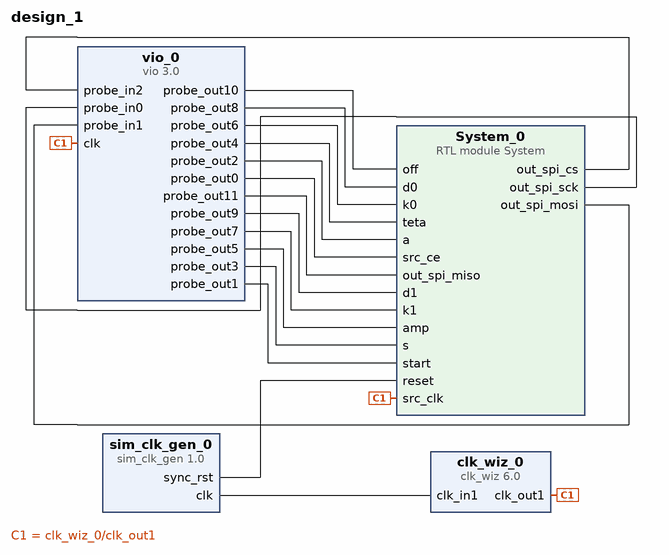
[diagram p0: block diagram of the top level]
# Vivado block design design_1, xc7s100fgga676-2, Vivado 2019.2
create_bd_design design_1

create_bd_cell -type ip -vlnv xilinx.com:ip:clk_wiz:6.0 clk_wiz_0
set_property -dict {CONFIG.USE_LOCKED false CONFIG.USE_RESET false} [get_bd_cells clk_wiz_0]
create_bd_cell -type ip -vlnv xilinx.com:ip:sim_clk_gen:1.0 sim_clk_gen_0
set_property -dict {CONFIG.RESET_POLARITY ACTIVE_LOW} [get_bd_cells sim_clk_gen_0]
create_bd_cell -type ip -vlnv xilinx.com:ip:vio:3.0 vio_0
set_property -dict [list \
  CONFIG.C_NUM_PROBE_IN 3 \
  CONFIG.C_NUM_PROBE_OUT 12 \
  CONFIG.C_PROBE_OUT0_INIT_VAL 0x1 \
  CONFIG.C_PROBE_OUT10_WIDTH 12 \
  CONFIG.C_PROBE_OUT1_INIT_VAL 0x1 \
  CONFIG.C_PROBE_OUT2_INIT_VAL 0x1 \
  CONFIG.C_PROBE_OUT2_WIDTH 4 \
  CONFIG.C_PROBE_OUT3_WIDTH 2 \
  CONFIG.C_PROBE_OUT4_WIDTH 8 \
  CONFIG.C_PROBE_OUT5_WIDTH 4 \
  CONFIG.C_PROBE_OUT6_INIT_VAL 0x10 \
  CONFIG.C_PROBE_OUT6_WIDTH 8 \
  CONFIG.C_PROBE_OUT7_INIT_VAL 0x10 \
  CONFIG.C_PROBE_OUT7_WIDTH 8 \
  CONFIG.C_PROBE_OUT8_INIT_VAL 0x08 \
  CONFIG.C_PROBE_OUT8_WIDTH 8 \
  CONFIG.C_PROBE_OUT9_INIT_VAL 0x08 \
  CONFIG.C_PROBE_OUT9_WIDTH 8 \
] [get_bd_cells vio_0]
create_bd_cell -type module -reference System System_0

# ---- connections ----

connect_bd_net [get_bd_pins sim_clk_gen_0/clk] [get_bd_pins clk_wiz_0/clk_in1]
connect_bd_net [get_bd_pins clk_wiz_0/clk_out1] [get_bd_pins vio_0/clk] [get_bd_pins System_0/src_clk]
connect_bd_net [get_bd_pins System_0/out_spi_cs] [get_bd_pins vio_0/probe_in2]
connect_bd_net [get_bd_pins System_0/out_spi_sck] [get_bd_pins vio_0/probe_in0]
connect_bd_net [get_bd_pins vio_0/probe_out10] [get_bd_pins System_0/off]
connect_bd_net [get_bd_pins vio_0/probe_out8] [get_bd_pins System_0/d0]
connect_bd_net [get_bd_pins vio_0/probe_out6] [get_bd_pins System_0/k0]
connect_bd_net [get_bd_pins vio_0/probe_out4] [get_bd_pins System_0/teta]
connect_bd_net [get_bd_pins vio_0/probe_out2] [get_bd_pins System_0/a]
connect_bd_net [get_bd_pins vio_0/probe_out0] [get_bd_pins System_0/src_ce]
connect_bd_net [get_bd_pins System_0/out_spi_mosi] [get_bd_pins vio_0/probe_in1]
connect_bd_net [get_bd_pins vio_0/probe_out11] [get_bd_pins System_0/out_spi_miso]
connect_bd_net [get_bd_pins vio_0/probe_out9] [get_bd_pins System_0/d1]
connect_bd_net [get_bd_pins vio_0/probe_out7] [get_bd_pins System_0/k1]
connect_bd_net [get_bd_pins vio_0/probe_out5] [get_bd_pins System_0/amp]
connect_bd_net [get_bd_pins vio_0/probe_out3] [get_bd_pins System_0/s]
connect_bd_net [get_bd_pins vio_0/probe_out1] [get_bd_pins System_0/start]
connect_bd_net [get_bd_pins sim_clk_gen_0/sync_rst] [get_bd_pins System_0/reset]

validate_bd_design
save_bd_design
